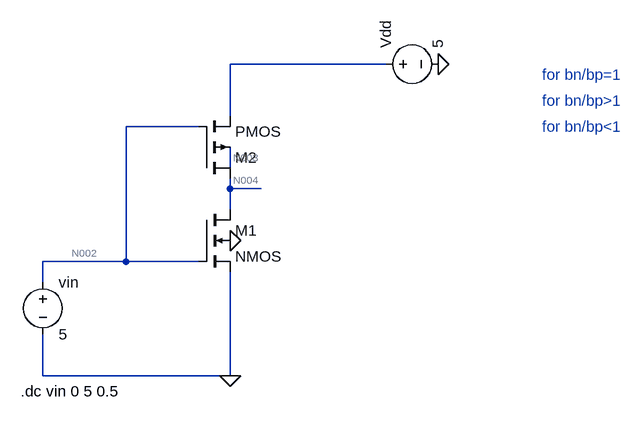
[diagram p0: schematic cmos.asc]
cmos.asc, the LTspice schematic file:
Version 4
SHEET 1 880 680
WIRE 352 -96 112 -96
WIRE 112 -16 112 -96
WIRE 64 0 -48 0
WIRE 112 64 112 32
WIRE 112 96 112 80
WIRE 160 96 112 96
WIRE 112 128 112 96
WIRE -48 208 -48 0
WIRE -48 208 -176 208
WIRE 64 208 -48 208
WIRE -176 240 -176 208
WIRE -176 384 -176 320
WIRE 112 384 112 224
WIRE 112 384 -176 384
FLAG 112 384 0
FLAG 112 176 0
FLAG 432 -96 0
SYMBOL voltage -176 224 R0
WINDOW 123 0 0 Left 2
WINDOW 39 0 0 Left 2
SYMATTR InstName vin
SYMATTR Value 5
SYMBOL nmos4 64 128 R0
SYMATTR InstName M1
SYMATTR Value2 l=10 w=20
SYMBOL pmos4 64 80 M180
SYMATTR InstName M2
SYMATTR Value2 l=10 w=10
SYMBOL voltage 336 -96 R270
WINDOW 123 0 0 Left 2
WINDOW 39 0 0 Left 2
SYMATTR InstName Vdd
SYMATTR Value 5
TEXT -210 408 Left 2 !.dc vin 0 5 0.5
TEXT 592 -80 Left 2 ;for bn/bp=1
TEXT 592 -40 Left 2 ;for bn/bp>1
TEXT 592 0 Left 2 ;for bn/bp<1

The netlist it stands for:
* cmos.asc
vin N002 0 5
M1 N004 N002 0 0 NMOS l=10 w=20
M2 N004 N002 N001 N003 PMOS l=10 w=10
Vdd N001 0 5
.model NMOS NMOS
.model PMOS PMOS
.lib standard.mos
.dc vin 0 5 0.5
* for bn/bp=1
* for bn/bp>1
* for bn/bp<1
.backanno
.end

* Results of the author's LTspice run, read from the files saved beside the schematic
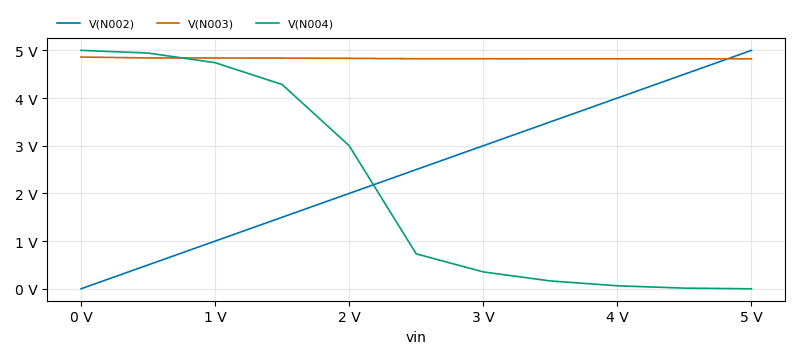
[diagram p1: DC transfer characteristic of cmos.asc, plotted from the saved traces]
* DC transfer characteristic, 1 run:
*   V(N002): 0 V at vin=0 V, 5 V at vin=5 V, min 0 V, max 5 V
*   V(N003): 4.859 V at vin=0 V, 4.823 V at vin=5 V, min 4.823 V, max 4.859 V
*   V(N004): 5 V at vin=0 V, 47.65 nV at vin=5 V, min 47.65 nV, max 5 V